# Altium schematic sheet LM2576-v2.SchDoc
size A
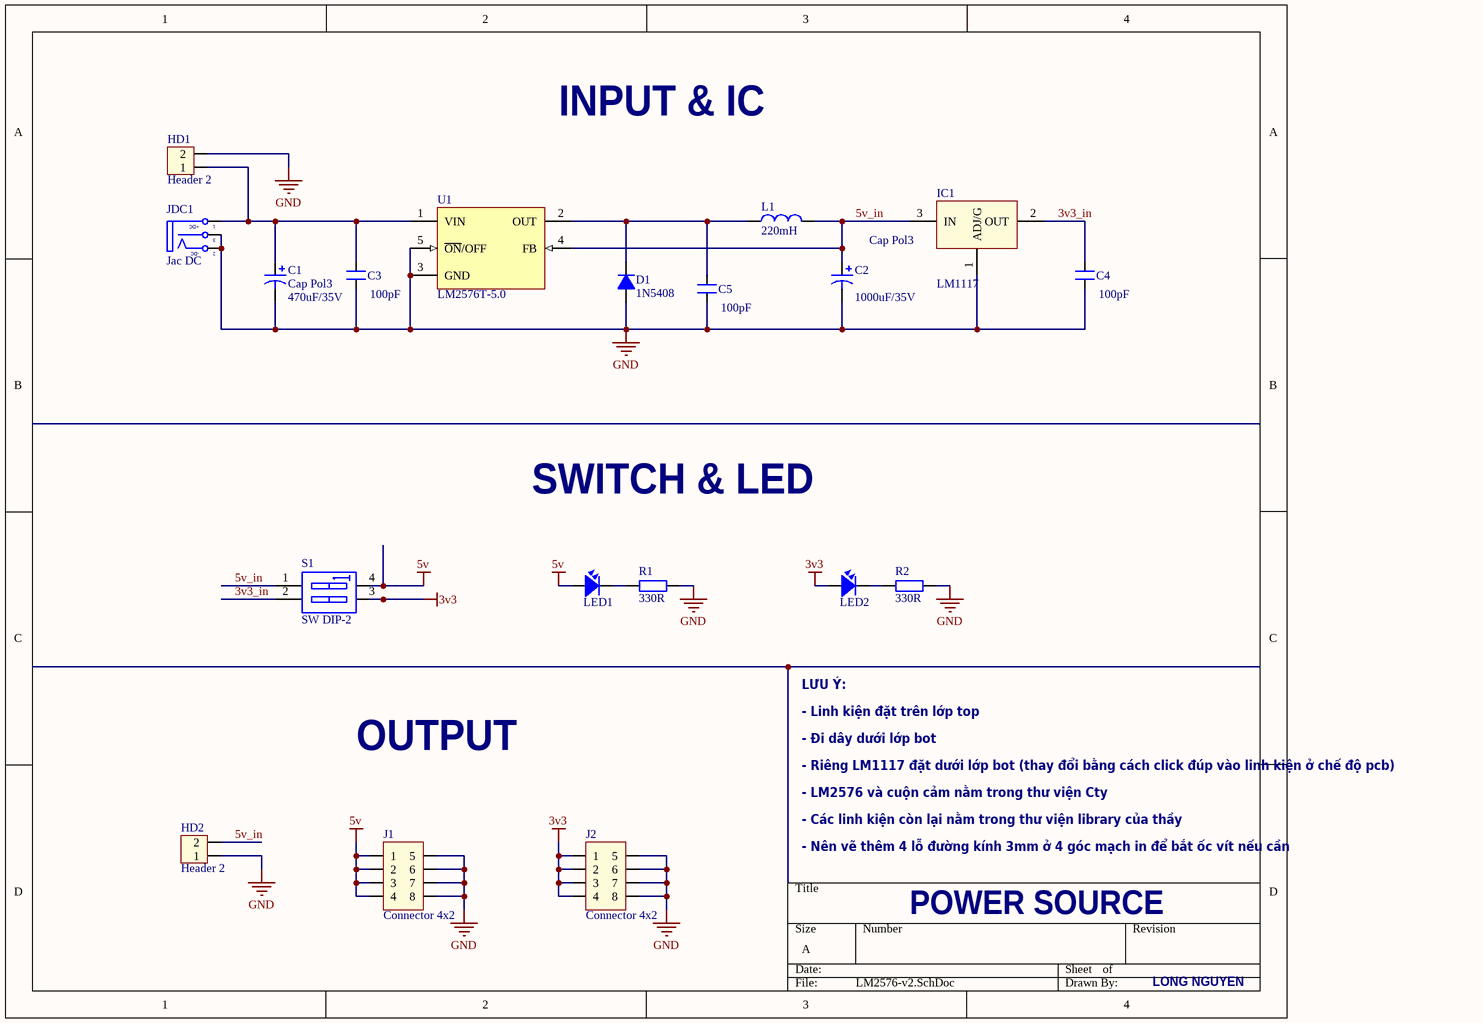
[diagram p0: LM2576-v2.SchDoc]

## Parts
C1  Cap Pol3  value 470uF/35V  [CP2/5]
C2  Cap Pol3  value 1000uF/35V  [CP2/5]
C3  100pF  [SM-CAP-3225]
C4  100pF  [SM-CAP-3225]
C5  100pF  [SM-CAP-3225]
D1  1N5408  [D5A]
HD1  Header 2  [HED2]
HD2  Header 2  [HED2]
IC1  LM1117  [SOT223-4N]
J1  Connector 4x2  [JP4x2]
J2  Connector 4x2  [JP4x2]
JDC1  Jac DC  [DC-IN]
L1  220mH  [L01]
LED1  LED  [SM-LED-0805-Red]  (value not drawn)
LED2  LED  [SM-LED-0805-Red]  (value not drawn)
R1  330R  [SM-RES-1206]
R2  330R  [SM-RES-1206]
S1  SW DIP-2  [DIPSWITCH2]
U1  LM2576T-5.0  [LM2576t]

## Nets
3v3: J2.1 J2.2 J2.3 J2.4 LED2.1 S1.3(B2)
5v: J1.1 J1.2 J1.3 J1.4 LED1.1 S1.4(B1)
GND: C1.2 C2.2 C3.1 C4.1 C5.1 D1.1(A) HD1.2 HD2.1 IC1.1(ADJ/G) J1.5 J1.6 J1.7 J1.8 J2.5 J2.6 J2.7 J2.8 JDC1.2(TN) JDC1.3(S) R1.2 R2.2 U1.3(GND) U1.5(~{ON}/OFF)
3v3_in: C4.2 IC1.2(OUT) S1.2(A2)
5v_in: C2.1 HD2.2 IC1.3(IN) L1.2 S1.1(A1) U1.4(FB)
NetC1_1: C1.1 C3.2 HD1.1 JDC1.1(T) U1.1(VIN)
NetC5_2: C5.2 D1.2(K) L1.1 U1.2(OUT)
NetLED1_2: LED1.2 R1.1
NetLED2_2: LED2.2 R2.1

## Notes on the sheet
- INPUT & IC
- SWITCH & LED
- LƯU Ý:
- OUTPUT
- - Linh kiện đặt trên lớp top
- - Đi dây dưới lớp bot
- - Riêng LM1117 đặt dưới lớp bot (thay đổi bằng cách click đúp vào linh kiện ở chế độ pcb)
- - LM2576 và cuộn cảm nằm trong thư viện Cty
- - Các linh kiện còn lại nằm trong thư viện library của thầy
- - Nên vẽ thêm 4 lỗ đường kính 3mm ở 4 góc mạch in để bắt ốc vít nếu cần
- POWER SOURCE
- LONG NGUYEN
- (in symbol DCIN) +DC; -DC

## Library data of the parts
C1 C2 = Cap Pol3: Polarized Capacitor (Surface Mount); VALUE: C?; LatestRevisionDate: 17-Jul-2002; LatestRevisionNote: Re-released for DXP Platform.; PackageReference: C0805; Publisher: Altium Limited
C3-C5 = CN1: Cap np  1pF - 472pF; Value: 100pF
D1 = D5A: Diode 5A; Value: 1N5408
HD1 HD2 = Hed2: Header 2 (Green); Value: Header 2
IC1 = LM1117: Available in 1.8V, 2.5V, 2.85V, 3.3V, 5V, and  Adjustable Versions; Value: LM317
J1 J2 = JP4x2: Value: Connector 4x2
JDC1 = DCIN: Jac DC input; Value: Jac DC
L1 = L1: Inductor; Value: 150 mH
LED1 LED2 = LED: LED Single colour Green and Red; Value: LED 3 ly Single Colour
R1 R2 = R1/4W: Resistor 1/4W; Value: R1/4W - 1K
S1 = SW DIP-2: DIP Switch, 2 Position, SPST; Published: 24-Mar-1999; LatestRevisionDate: 17-Jul-2002; LatestRevisionNote: Re-released for DXP Platform.; PackageReference: DIP-4; Publisher: Altium Limited
U1 = LM2576T-5.0: SIMPLE SWITCHER; 3A Step-Down Voltage Regulator; Manufacturer: National Semiconductor; PackageTopMarking: NSUZXYTT*LM2576T*-5.0 P+; PowerWise: N; FirstPublished: 4-Dec-2008; DatasheetVersion: Aug-2004; PackageVersion: revJ, Jan-1992; PackageReference: T05A; Publisher: Altium Limited; PackageDescription: TO-220, Molded, 5 Lead, Straight; CompType: Switcher; PartNumber: LM2576T-5.0; RoHS: O; PinCount: 5; DigiKeyPartNumber: LM2576T-5.0-ND; Code_JEDEC: TO-220-AB; ComponentLink1Description: LM2576 Datasheet; ComponentLink1URL: http://www.national.com/ds/LM/LM2576.pdf; ComponentLink2Description: LM2576 Web Page; ComponentLink2URL: http://www.national.com/pf/LM/LM2576.html; ComponentLink3Description: T05A Package Page; ComponentLink3URL: http://www.national.com/packaging/folders/t05a.html